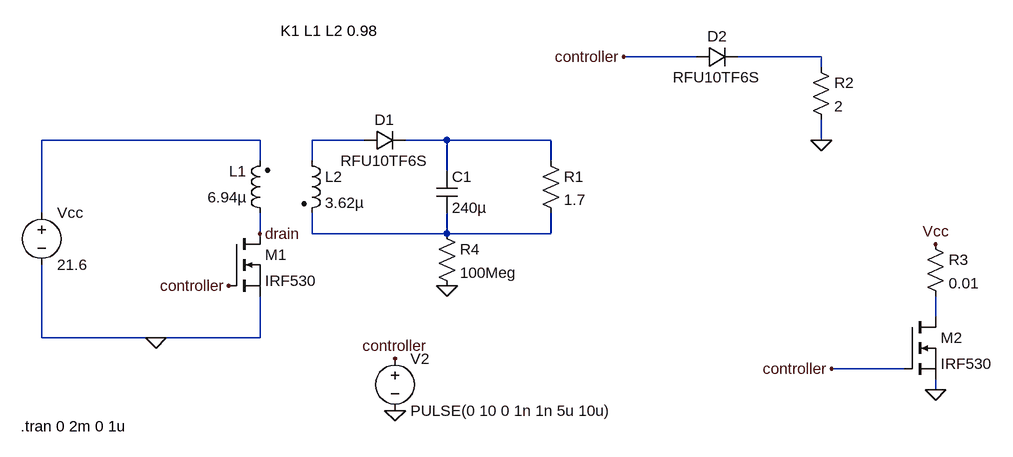
[diagram p0: schematic TP Final.asc]
TP Final.asc, the LTspice schematic file:
Version 4
SHEET 1 1592 680
WIRE 752 -48 640 -48
WIRE 944 -48 816 -48
WIRE 944 -32 944 -48
WIRE 80 80 -256 80
WIRE 240 80 160 80
WIRE 368 80 304 80
WIRE 528 80 368 80
WIRE 944 80 944 48
WIRE 80 112 80 80
WIRE 160 112 160 80
WIRE 528 112 528 80
WIRE 368 128 368 80
WIRE -256 192 -256 80
WIRE 80 224 80 192
WIRE 160 224 160 192
WIRE 368 224 368 192
WIRE 368 224 160 224
WIRE 528 224 528 192
WIRE 528 224 368 224
WIRE 1120 352 1120 320
WIRE -256 384 -256 272
WIRE -80 384 -256 384
WIRE 80 384 80 320
WIRE 80 384 -80 384
WIRE 1072 432 960 432
WIRE 1120 464 1120 448
FLAG -80 384 0
FLAG 288 496 0
FLAG 288 416 controller
FLAG 32 304 controller
FLAG 944 80 0
FLAG 640 -48 controller
FLAG 960 432 controller
FLAG 1120 464 0
FLAG 1120 240 Vcc
FLAG 368 304 0
FLAG 80 224 drain
SYMBOL ind2 96 208 R180
WINDOW 0 36 80 Left 2
WINDOW 3 36 40 Left 2
SYMATTR InstName L1
SYMATTR Value 6.94µ
SYMATTR Type ind
SYMBOL ind2 144 96 R0
SYMATTR InstName L2
SYMATTR Value 3.62µ
SYMATTR Type ind
SYMBOL diode 240 96 R270
WINDOW 0 32 32 VTop 2
WINDOW 3 0 32 VBottom 2
SYMATTR InstName D1
SYMATTR Value RFU10TF6S
SYMBOL cap 352 128 R0
SYMATTR InstName C1
SYMATTR Value 240µ
SYMBOL voltage -256 176 R0
WINDOW 123 0 0 Left 0
WINDOW 39 0 0 Left 0
SYMATTR InstName Vcc
SYMATTR Value 21.6
SYMBOL res 512 96 R0
SYMATTR InstName R1
SYMATTR Value 1.7
SYMBOL voltage 288 400 R0
WINDOW 123 0 0 Left 0
WINDOW 39 0 0 Left 0
SYMATTR InstName V2
SYMATTR Value PULSE(0 10 0 1n 1n 5u 10u)
SYMBOL diode 752 -32 R270
WINDOW 0 32 32 VTop 2
WINDOW 3 0 32 VBottom 2
SYMATTR InstName D2
SYMATTR Value RFU10TF6S
SYMBOL res 928 -48 R0
SYMATTR InstName R2
SYMATTR Value 2
SYMBOL nmos 1072 352 R0
SYMATTR InstName M2
SYMATTR Value IRF530
SYMBOL res 1104 224 R0
SYMATTR InstName R3
SYMATTR Value 0.01
SYMBOL nmos 32 224 R0
SYMATTR InstName M1
SYMATTR Value IRF530
SYMBOL res 352 208 R0
SYMATTR InstName R4
SYMATTR Value 100Meg
TEXT 112 -88 Left 2 !K1 L1 L2 0.98
TEXT -288 520 Left 2 !.tran 0 2m 0 1u

The netlist it stands for:
* TP Final.asc
L1 drain N002 6.94µ
L2 N003 N005 3.62µ
D1 N003 N004 RFU10TF6S
C1 N004 N005 240µ
Vcc N002 0 21.6
R1 N004 N005 1.7
V2 controller 0 PULSE(0 10 0 1n 1n 5u 10u)
D2 controller N001 RFU10TF6S
R2 N001 0 2
M2 N006 controller 0 0 IRF530
R3 Vcc N006 0.01
M1 drain controller 0 0 IRF530
R4 N005 0 100Meg
.model D D
.lib standard.dio
.model NMOS NMOS
.model PMOS PMOS
.lib standard.mos
K1 L1 L2 0.98
.tran 0 2m 0 1u
.backanno
.end